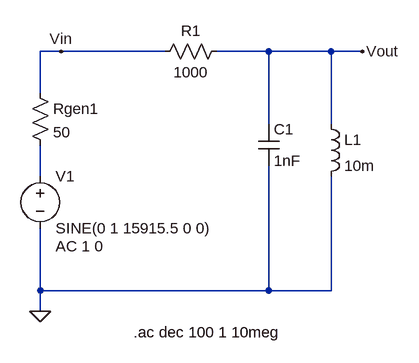
[diagram p0: schematic RLC_bandpass_filter.asc]
RLC_bandpass_filter.asc, the LTspice schematic file:
Version 4
SHEET 1 880 680
WIRE -32 -64 -64 -64
WIRE 128 -64 -32 -64
WIRE 288 -64 208 -64
WIRE 384 -64 288 -64
WIRE 432 -64 384 -64
WIRE -64 0 -64 -64
WIRE 288 48 288 -64
WIRE 384 48 384 -64
WIRE -64 128 -64 80
WIRE -64 304 -64 208
WIRE 288 304 288 112
WIRE 288 304 -64 304
WIRE 384 304 384 128
WIRE 384 304 288 304
WIRE -64 336 -64 304
FLAG -64 336 0
FLAG 432 -64 Vout
FLAG -32 -64 Vin
SYMBOL voltage -64 112 R0
WINDOW 123 24 124 Left 2
WINDOW 39 0 0 Left 0
SYMATTR Value2 AC 1 0
SYMATTR InstName V1
SYMATTR Value SINE(0 1 15915.5 0 0)
SYMBOL res -80 -16 R0
SYMATTR InstName Rgen1
SYMATTR Value 50
SYMBOL res 224 -80 R90
WINDOW 0 0 56 VBottom 2
WINDOW 3 32 56 VTop 2
SYMATTR InstName R1
SYMATTR Value 1000
SYMBOL ind 368 32 R0
SYMATTR InstName L1
SYMATTR Value 10m
SYMBOL cap 272 48 R0
SYMATTR InstName C1
SYMATTR Value 1nF
TEXT 80 368 Left 2 !.ac dec 100 1 10meg

The netlist it stands for:
* RLC_bandpass_filter.asc
V1 N001 0 SINE(0 1 15915.5 0 0) AC 1 0
Rgen1 Vin N001 50
R1 Vout Vin 1000
L1 Vout 0 10m
C1 Vout 0 1nF
.ac dec 100 1 10meg
.backanno
.end